# Altium schematic sheet Sheet1.SchDoc
size C
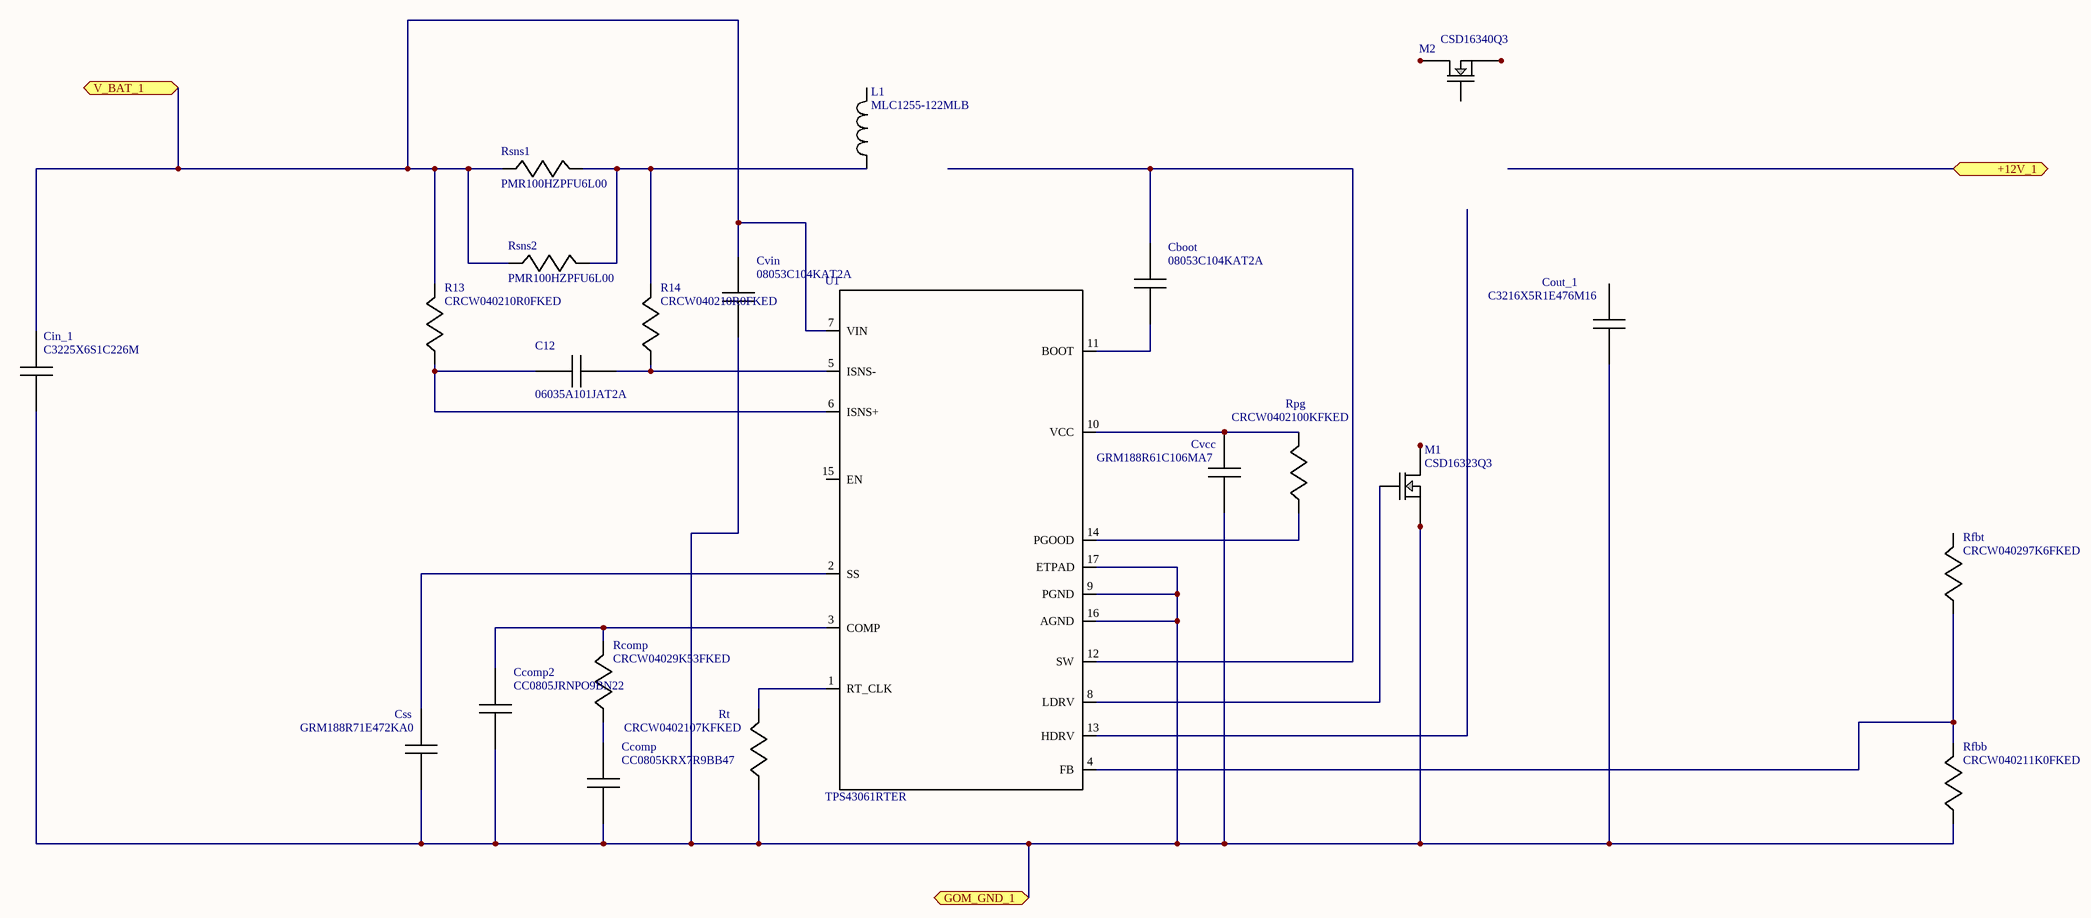
[diagram p0: Sheet1.SchDoc]

## Parts
C12  06035A101JAT2A  [0603]
Cboot  08053C104KAT2A  [0805]
Ccomp  CC0805KRX7R9BB47  [0805]
Ccomp2  CC0805JRNPO9BN22  [0805]
Cin_1  C3225X6S1C226M  [1210]
Cout_1  C3216X5R1E476M16  [1206_190]
Css  GRM188R71E472KA0  [0603]
Cvcc  GRM188R61C106MA7  [0603]
Cvin  08053C104KAT2A  [0805]
L1  MLC1255-122MLB  [MLC1255]
M1  CSD16323Q3  [TRANS_NexFET_Q3]
M2  CSD16340Q3  [TRANS_NexFET_Q3]
R13  CRCW040210R0FKED  [0402]
R14  CRCW040210R0FKED  [0402]
Rcomp  CRCW04029K53FKED  [0402]
Rfbb  CRCW040211K0FKED  [0402]
Rfbt  CRCW040297K6FKED  [0402]
Rpg  CRCW0402100KFKED  [0402]
Rsns1  PMR100HZPFU6L00  [2512]
Rsns2  PMR100HZPFU6L00  [2512]
Rt  CRCW0402107KFKED  [0402]
U1  TPS43061RTER  [S-PVQFN-N16]

## Ports
+12V_1 (bidir), GOM_GND_1 (bidir), V_BAT_1 (bidir)

## Nets
GOM_GND_1: Ccomp.2 Ccomp2.2 Cin_1.2 Cout_1.2 Css.1 Cvcc.2 Cvin.2 M1.1(Source) M1.2(Source) M1.3(Source) Rfbb.2 Rt.2 U1.9(PGND) U1.16(AGND) U1.17(ETPAD) ; port GOM_GND_1
V_BAT_1: Cin_1.1 Cvin.1 R13.1 Rsns1.2 Rsns2.2 U1.7(VIN) ; port V_BAT_1
NetC12_1: C12.1 R14.2 U1.5(ISNS-)
NetC12_2: C12.2 R13.2 U1.6(ISNS+)
NetCboot_1: Cboot.1 U1.12(SW)
NetCboot_2: Cboot.2 U1.11(BOOT)
NetCcomp2_1: Ccomp2.1 Rcomp.1 U1.3(COMP)
NetCcomp_1: Ccomp.1 Rcomp.2
NetCss_2: Css.2 U1.2(SS)
NetCvcc_1: Cvcc.1 Rpg.1 U1.10(VCC)
NetL1_1: L1.1 R14.1 Rsns1.1 Rsns2.1
NetM1_4: M1.4(Gate) U1.8(LDRV)
NetM1_5: M1.5(Drain) M1.6(Drain) M1.7(Drain) M1.8(Drain) M1.9(Drain)
NetM2_1: M2.1(Source) M2.2(Source) M2.3(Source)
NetM2_5: M2.5(Drain) M2.6(Drain) M2.7(Drain) M2.8(Drain) M2.9(Drain)
NetRfbb_1: Rfbb.1 Rfbt.2 U1.4(FB)
NetRpg_2: Rpg.2 U1.14(PGOOD)
NetRt_1: Rt.1 U1.1(RT_CLK)

Not connected (* = marked no-connect by the designer): Cout_1 1; L1 2; M2 4(Gate); Rfbt 1; U1 13(HDRV) 15(EN)

## Library data of the parts
C12 = 06035A101JAT2A: Imported; Vendor: AVX; Value: 100pF; Manufacturer_Part_Number: 06035A101JAT2A; Manufacturer_Name: AVX; RefDes: RefDes; TYPE: TYPE
Cboot Cvin = 08053C104KAT2A: Imported; Vendor: AVX; Value: 100nF; Manufacturer_Part_Number: 08053C104KAT2A; Manufacturer_Name: AVX; RefDes: RefDes; TYPE: TYPE
Ccomp = CC0805KRX7R9BB47: Imported; Manufacturer_Part_Number: CC0805KRX7R9BB472; Vendor: Yageo America; Value: 4.7nF; Manufacturer_Name: Yageo America; RefDes: RefDes; TYPE: TYPE
Ccomp2 = CC0805JRNPO9BN22: Imported; Manufacturer_Part_Number: CC0805JRNPO9BN221; Vendor: Yageo America; Value: 220pF; Manufacturer_Name: Yageo America; RefDes: RefDes; TYPE: TYPE
Cin_1 = C3225X6S1C226M: Imported; Vendor: TDK; Value: 22uF; Manufacturer_Part_Number: C3225X6S1C226M; Manufacturer_Name: TDK; RefDes: RefDes; TYPE: TYPE
Cout_1 = C3216X5R1E476M16: Imported; Manufacturer_Part_Number: C3216X5R1E476M160AC; Manufacturer_Name: TDK; Cap_F: 0.000047; VDC_V: 25; Value: 47uF; RoHS: Y; MountType: SMT; RefDes: RefDes; TYPE: TYPE
Css = GRM188R71E472KA0: Imported; Manufacturer_Part_Number: GRM188R71E472KA01D; Vendor: MuRata; Value: 4.7nF; Manufacturer_Name: MuRata; RefDes: RefDes; TYPE: TYPE
Cvcc = GRM188R61C106MA7: Imported; Manufacturer_Part_Number: GRM188R61C106MA73D; Cap: 1.0E-5; ESR: 0; VDC: 16; Vendor: Murata; Value: 10uF; IRMS: 0; Manufacturer_Name: MuRata; RefDes: RefDes; TYPE: TYPE
L1 = MLC1255-122MLB: Imported; Vendor: Coilcraft; Value: 1.2uH; Manufacturer_Part_Number: MLC1255-122MLB; Manufacturer_Name: Coilcraft; RefDes: RefDes; TYPE: TYPE
M1 = CSD16323Q3: Imported; Vendor: Texas Instruments; Value: 25V; Manufacturer_Part_Number: CSD16323Q3; Manufacturer_Name: Texas Instruments; RefDes: RefDes; TYPE: TYPE
M2 = CSD16340Q3: Imported; Vendor: Texas Instruments; Value: 25V; Manufacturer_Part_Number: CSD16340Q3; Manufacturer_Name: Texas Instruments; RefDes: RefDes; TYPE: TYPE
R13 R14 = CRCW040210R0FKED: Imported; Vendor: Vishay-Dale; Value: 10; Manufacturer_Part_Number: CRCW040210R0FKED; Manufacturer_Name: Vishay-Dale; RefDes: RefDes; TYPE: TYPE
Rcomp = CRCW04029K53FKED: Imported; Vendor: Vishay-Dale; Value: 9.53k; Manufacturer_Part_Number: CRCW04029K53FKED; Manufacturer_Name: Vishay-Dale; RefDes: RefDes; TYPE: TYPE
Rfbb = CRCW040211K0FKED: Imported; Vendor: Vishay-Dale; Value: 11k; Manufacturer_Part_Number: CRCW040211K0FKED; Manufacturer_Name: Vishay-Dale; RefDes: RefDes; TYPE: TYPE
Rfbt = CRCW040297K6FKED: Imported; Vendor: Vishay-Dale; Value: 97.6k; Manufacturer_Part_Number: CRCW040297K6FKED; Manufacturer_Name: Vishay-Dale; RefDes: RefDes; TYPE: TYPE
Rpg = CRCW0402100KFKED: Imported; Vendor: Vishay-Dale; Value: 100k; Manufacturer_Part_Number: CRCW0402100KFKED; Manufacturer_Name: Vishay-Dale; RefDes: RefDes; TYPE: TYPE
Rsns1 Rsns2 = PMR100HZPFU6L00: Imported; Vendor: Rohm; Value: 6m; Manufacturer_Part_Number: PMR100HZPFU6L00; Manufacturer_Name: Rohm; RefDes: RefDes; TYPE: TYPE
Rt = CRCW0402107KFKED: Imported; Vendor: Vishay-Dale; Value: 107k; Manufacturer_Part_Number: CRCW0402107KFKED; Manufacturer_Name: Vishay-Dale; RefDes: RefDes; TYPE: TYPE
U1 = TPS43061RTER: Imported; Vendor: Texas Instruments; Manufacturer_Part_Number: TPS43061RTER; Manufacturer_Name: Texas Instruments; RefDes: RefDes; TYPE: TYPE; Value: Value